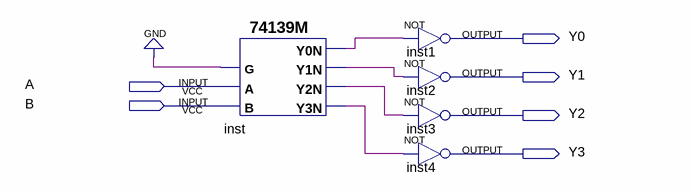
[diagram p0: schematic sheet]
// Quartus schematic decoder2_4.bdf as structural Verilog: 5 symbols, 6 pins
module decoder2_4 (
  input  A,
  input  B,
  output Y0,
  output Y1,
  output Y2,
  output Y3
);

  wire inst_y0n, inst_y1n, inst_y2n, inst_y3n;

  \74139M  inst (.B(B), .A(A), .G(1'b0), .Y3N(inst_y3n), .Y2N(inst_y2n), .Y0N(inst_y0n), .Y1N(inst_y1n));
  not inst1 (Y0, inst_y0n);
  not inst2 (Y1, inst_y1n);
  not inst3 (Y2, inst_y2n);
  not inst4 (Y3, inst_y3n);
endmodule
